# Altium project PCE_ROBOT.PrjPCB
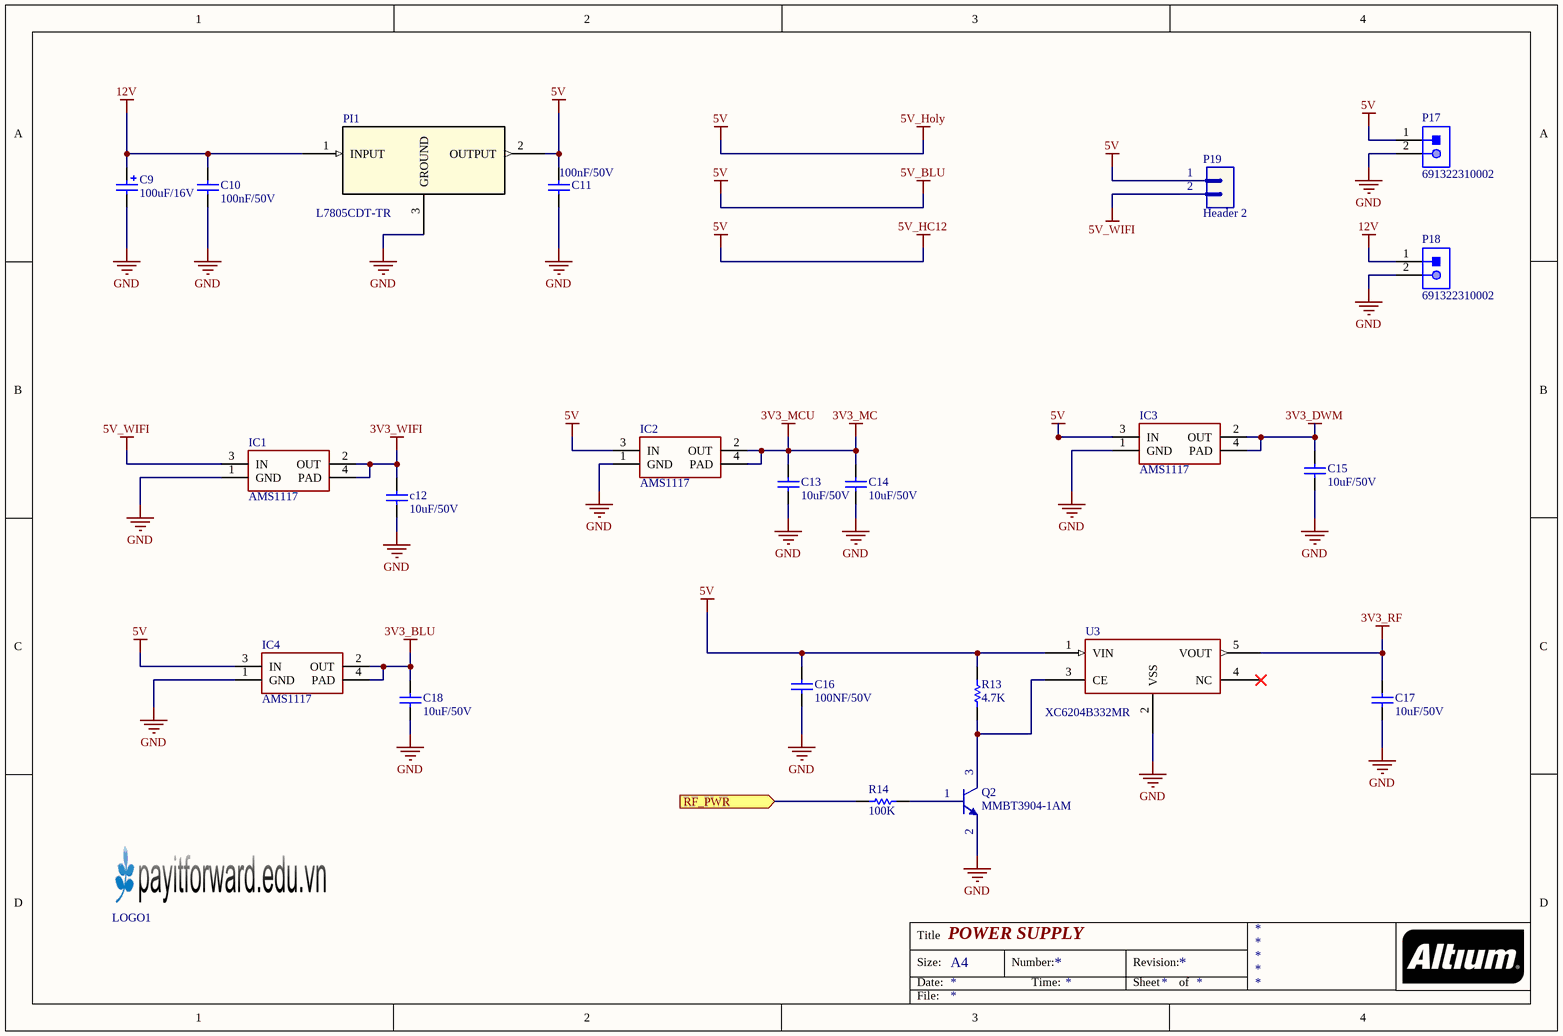
[diagram p0: POWER_SUPPLY.SchDoc]
8 sheets, 154 parts. Net scope: flat (ports and power ports of the same name join across sheets).
Board file: cainaylacaicuoihualuona.PcbDoc
Sheets:
  POWER_SUPPLY.SchDoc
  MCU.SchDoc
  SENSOR.SchDoc
  MOTOR_CONTROL.SchDoc
  BLUETOOTH.SchDoc
  WIFI.SchDoc
  RF.SchDoc
  DACEWAVE.SchDoc

## Sheet POWER_SUPPLY.SchDoc: POWER SUPPLY
size A4

### Parts
C9  value 100uF/16V  [CAP-SM-AL-SIZE-D-D6L6]  (hidden comment: Cap-Al-47uF-50V-D6L8)
C10  value 100nF/50V  [CAP-SM-0805]  (hidden comment: Cap-100nF-50V-0805)
C11  value 100nF/50V  [CAP-SM-0805]  (hidden comment: Cap-100nF-50V-0805)
c12  value 10uF/50V  [CAP-SM-0805]  (hidden comment: Cap-10uF-50V-0805)
C13  value 10uF/50V  [CAP-SM-0805]  (hidden comment: Cap-10uF-50V-0805)
C14  value 10uF/50V  [CAP-SM-0805]  (hidden comment: Cap-10uF-50V-0805)
C15  value 10uF/50V  [CAP-SM-0805]  (hidden comment: Cap-10uF-50V-0805)
C16  value 100NF/50V  [CAP-SM-0805]  (hidden comment: Cap-10uF-50V-0805)
C17  value 10uF/50V  [CAP-SM-0805]  (hidden comment: Cap-10uF-50V-0805)
C18  value 10uF/50V  [CAP-SM-0805]  (hidden comment: Cap-10uF-50V-0805)
IC1  AMS1117  [SOT223]
IC2  AMS1117  [SOT223]
IC3  AMS1117  [SOT223]
IC4  AMS1117  [SOT223]
LOGO1  LOGO PIF  [PIF LOGO BIG SSTOP]  (value not drawn)
P17  691322310002  [691322310002]
P18  691322310002  [691322310002]
P19  Header 2  [JP2]
PI1  L7805CDT-TR  [L7805]
Q2  MMBT3904-1AM  [SOT23_NEX]
R13  value 4.7K  [RES-SM-0805]  (hidden comment: Res-0-0805)
R14  value 100K  [RES-SM-0805]  (hidden comment: Res-0-0805)
U3  XC6204B332MR  [XC6204/05_SOT-00]

### Ports
RF_PWR (in)

### Nets
3V3_BLU: C18.2 IC4.2(OUT) IC4.4(PAD)
3V3_DWM: C15.2 IC3.2(OUT) IC3.4(PAD)
3V3_MCU: C13.2 C14.2 IC2.2(OUT) IC2.4(PAD)  [also labelled 3V3_MC]
3V3_RF: C17.2 U3.5(VOUT)
3V3_WIFI: c12.2 IC1.2(OUT) IC1.4(PAD)
5V: C11.2 C16.2 IC2.3(IN) IC3.3(IN) IC4.3(IN) P17.1 P19.1 PI1.2(OUTPUT) R13.1 U3.1(VIN)  [also labelled 5V_BLU, 5V_HC12, 5V_Holy]
5V_WIFI: IC1.3(IN) P19.2
12V: C9.1 C10.2 P18.1 PI1.1(INPUT)
GND: C9.2 C10.1 C11.1 c12.1 C13.1 C14.1 C15.1 C16.1 C17.1 C18.1 IC1.1(GND) IC2.1(GND) IC3.1(GND) IC4.1(GND) P17.2 P18.2 PI1.3(GROUND) Q2.2(E) U3.2(VSS)
Net?_15: R14.1 ; port RF_PWR
NetQ2_1: Q2.1(B) R14.2
NetQ2_3: Q2.3(C) R13.2 U3.3(CE)

Not connected (* = marked no-connect by the designer): U3 4(NC)*

### Notes on the sheet
- Title
- Size:
- Date:
- A4
- Number:
- Time:
- Revision:
- Sheet
- of
- File:

### Library data of the parts
C9 = Cap-Al-47uF-50V-D6L8: CAP ALUM POLY 47UF 20% 50V SMD; Manufacturer: KEMET; Manufacturer Part Number: A767KN476M1HLAE029; Local Supplier: thegioiic; Local Supplier Link: https://thegioiic.com/products/tu-nhom-smd-47uf-50v-d6l8; Supplier 1: Digikey; Supplier 1 Link: https://www.digikey.com/product-detail/en/kemet/A767KN476M1HLAE029/399-16576-1-ND/7933076; Supplier 1 Part Number: 399-16576-1-ND
C10 C11 = Cap-100nF-50V-0805: CAP CER 0.1UF 50V Y5V 0805; Manufacturer: Samsung Electro-Mechanics; Manufacturer Part Number: CL21F104ZBCNNNC; Local Supplier: thegioiic; Local Supplier Link: https://thegioiic.com/products/tu-100nf-0-1uf-50v-0805; Supplier 1: Digikey; Supplier 1 Part Number: 1276-1007-1-ND; Supplier 1 Link: https://www.digikey.com/product-detail/en/samsung-electro-mechanics/CL21F104ZBCNNNC/1276-1007-1-ND/3889093
c12 C13-C18 = Cap-10uF-50V-0805: CAP CER 10UF 50V X5R 0805; Manufacturer: Yageo; Manufacturer Part Number: CC0805KKX5R9BB106; Local Supplier: thegioiic; Local Supplier Link: https://thegioiic.com/products/tu-10uf-50v-0805; Supplier 1: Digikey; Supplier 1 Link: https://www.digikey.com/product-detail/en/yageo/CC0805KKX5R9BB106/311-3499-2-ND/7164383; Supplier 1 Part Number: 311-3499-2-ND
IC1-IC4 = AMS1117: Available in 1.8V, 2.5V, 2.85V, 3.3V, 5V, and  Adjustable Versions; Value: LM317
P17 P18 = 691322310002: WR-TBL Serie 322 Horizontal PCB Header, Pluggable, pitch 3.81mm, 2p; Compliance: RoHS; Modularity: No; Pin Number: 2; Rated Current [UL]: 10A; Working Voltage [UL]: 300VAC; ComponentLink1Description: Manufacturer; ComponentLink1URL: http://www.we-online.de; ComponentLink2URL: https://katalog.we-online.de/em/datasheet/691322310002.pdf; ComponentLink2Description: Datasheet; Mounting Technology: THT; Part Number: 691322310002; Packaging: Box; Operating Temperature: -40 to +105degC; PCB/Cable/Panel: PCB; Pitch: 3.81mm; Published Date: October 2019; Type: Horizontal; Publisher: Wurth Elektronik; Application: Pluggable
P19 = Header 2: Header, 2-Pin; LatestRevisionDate: 17-Jul-2002; LatestRevisionNote: Re-released for DXP Platform.; Publisher: Altium Limited
PI1 = L7805: No Description Available; SourceLibrary: StMicro_2011-06-07; Built_By: EMA_UL_Team; Vendor: STMicroelectronics; Manufacturer_Part_Number: L7805CDT-TR; Copyright: Copyright (C) 2018 Accelerated Designs. All rights reserved; RefDes: RefDes; Type: DEV
R13 R14 = Res-0-0805: RES 0 OHM JUMPER 0805; Manufacturer: Vishay Dale; Manufacturer Part Number: WSL080500000ZEA9; Local Supplier: thegioiic; Local Supplier Link: https://thegioiic.com/products/dien-tro-0-ohm-0805-5; Supplier 1: Digikey; Supplier 1 Link: https://www.digikey.com/product-detail/en/vishay-dale/WSL080500000ZEA9/541-3928-1-ND/7423223; Supplier 1 Part Number: 541-3928-1-ND
U3 = XC6204B332MR: Vendor: Torex Semiconductor; Built_By: EMA_UL_Team; SourceLibrary: Torex_2016-07-05_1; Manufacturer_Part_Number: XC6204B332MR; Copyright: Copyright (C) 2018 Accelerated Designs. All rights reserved; RefDes: RefDes; Type: DEV

## Sheet MCU.SchDoc: MCU
size A4
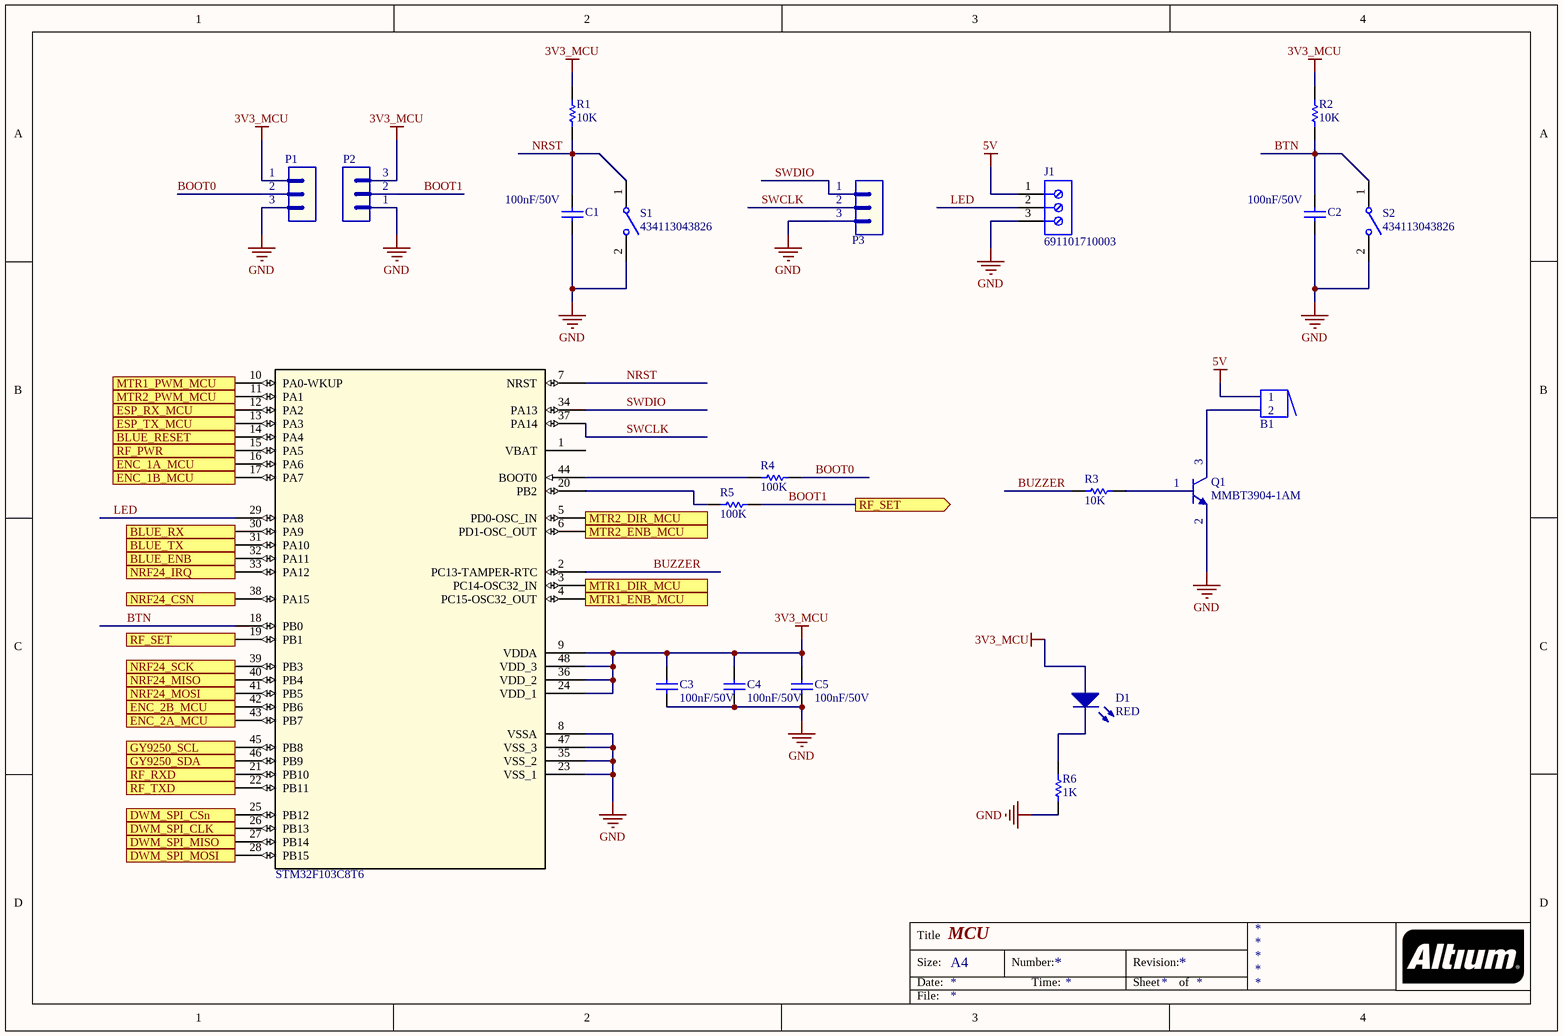
[diagram p1: MCU.SchDoc]

### Parts
?  STM32F103C8T6  [STM32]
B1  Buzzer  [BUZZER]  (value not drawn)
C1  value 100nF/50V  [CAP-SM-0805]  (hidden comment: Cap-1nF-50V-0805)
C2  value 100nF/50V  [CAP-SM-0805]  (hidden comment: Cap-1nF-50V-0805)
C3  value 100nF/50V  [CAP-SM-0805]  (hidden comment: Cap-100pF-50V-0805)
C4  value 100nF/50V  [CAP-SM-0805]  (hidden comment: Cap-100pF-50V-0805)
C5  value 100nF/50V  [CAP-SM-0805]  (hidden comment: Cap-100pF-50V-0805)
D1  RED  [LED_0805_Blue]
J1  691101710003  [691101710003]
P1  Header 3  [JP3]  (value not drawn)
P2  Header 3  [JP3]  (value not drawn)
P3  Header 3  [JP3]  (value not drawn)
Q1  MMBT3904-1AM  [SOT23_NEX]
R1  value 10K  [RES-SM-0805]  (hidden comment: Res-0-0805)
R2  value 10K  [RES-SM-0805]  (hidden comment: Res-0-0805)
R3  value 10K  [RES-SM-0805]  (hidden comment: Res-0-0805)
R4  value 100K  [RES-SM-0805]  (hidden comment: Res-0-0805)
R5  value 100K  [RES-SM-0805]  (hidden comment: Res-0-0805)
R6  value 1K  [RES-SM-0805]  (hidden comment: Res-0-0805)
S1  434113043826  [434113043826]
S2  434113043826  [434113043826]

### Ports
BLUE_ENB (out), BLUE_RESET (out), BLUE_RX (out), BLUE_TX (in), DWM_SPI_CLK (out), DWM_SPI_CSn (out), DWM_SPI_MISO (in), DWM_SPI_MOSI (out), ENC_1A_MCU (in), ENC_1B_MCU (in), ENC_2A_MCU (in), ENC_2B_MCU (in), ESP_RX_MCU (out), ESP_TX_MCU (in), GY9250_SCL (out), GY9250_SDA (out), MTR1_DIR_MCU (out), MTR1_ENB_MCU (out), MTR1_PWM_MCU (out), MTR2_DIR_MCU (out), MTR2_ENB_MCU (out), MTR2_PWM_MCU (out), NRF24_CSN (out), NRF24_IRQ (in), NRF24_MISO (in), NRF24_MOSI (out), NRF24_SCK (out), RF_PWR (out), RF_RXD (out), RF_SET (out), RF_TXD (in)

### Nets
3V3_MCU: ?.9(VDDA) ?.24(VDD_1) ?.36(VDD_2) ?.48(VDD_3) C3.1 C4.1 C5.1 D1.1(A) P1.1 P2.3 R1.2 R2.2
5V: B1.1 J1.1
GND: ?.8(VSSA) ?.23(VSS_1) ?.35(VSS_2) ?.47(VSS_3) C1.1 C2.1 C3.2 C4.2 C5.2 J1.3 P1.3 P2.1 P3.3 Q1.2(E) R6.1 S1.2 S2.2
BLUE_ENB: ?.32(PA11) ; port BLUE_ENB
BLUE_RX: ?.30(PA9) ; port BLUE_RX
BLUE_TX: ?.31(PA10) ; port BLUE_TX
BOOT0: P1.2 R4.2
BOOT1: ?.19(PB1) P2.2 R5.2 ; port RF_SET
BTN: ?.18(PB0) C2.2 R2.1 S2.1
BUZZER: ?.2(PC13-TAMPER-RTC) R3.2
ESP_TX: ?.13(PA3) ; port ESP_TX_MCU
LED: ?.29(PA8) J1.2
NRST: ?.7(NRST) C1.2 R1.1 S1.1
RF_RXD: ?.21(PB10) ; port RF_RXD
RF_TXD: ?.22(PB11) ; port RF_TXD
SWCLK: ?.37(PA14) P3.2
SWDIO: ?.34(PA13) P3.1
Net*_26: ?.27(PB14) ; port DWM_SPI_MISO
Net*_27: ?.28(PB15) ; port DWM_SPI_MOSI
Net*_28: ?.26(PB13) ; port DWM_SPI_CLK
Net*_29: ?.25(PB12) ; port DWM_SPI_CSn
Net?_3: ?.3(PC14-OSC32_IN) ; port MTR1_DIR_MCU
Net?_4: ?.4(PC15-OSC32_OUT) ; port MTR1_ENB_MCU
Net?_5: ?.5(PD0-OSC_IN) ; port MTR2_DIR_MCU
Net?_6: ?.6(PD1-OSC_OUT) ; port MTR2_ENB_MCU
Net?_10: ?.10(PA0-WKUP) ; port MTR1_PWM_MCU
Net?_11: ?.11(PA1) ; port MTR2_PWM_MCU
Net?_12: ?.12(PA2) ; port ESP_RX_MCU
Net?_14: ?.14(PA4) ; port BLUE_RESET
Net?_15: ?.15(PA5) ; port RF_PWR
Net?_16: ?.16(PA6) ; port ENC_1A_MCU
Net?_17: ?.17(PA7) ; port ENC_1B_MCU
Net?_20: ?.20(PB2) R5.1
Net?_33: ?.33(PA12) ; port NRF24_IRQ
Net?_38: ?.38(PA15) ; port NRF24_CSN
Net?_39: ?.39(PB3) ; port NRF24_SCK
Net?_40: ?.40(PB4) ; port NRF24_MISO
Net?_41: ?.41(PB5) ; port NRF24_MOSI
Net?_42: ?.42(PB6) ; port ENC_2B_MCU
Net?_43: ?.43(PB7) ; port ENC_2A_MCU
Net?_44: ?.44(BOOT0) R4.1
Net?_45: ?.45(PB8) ; port GY9250_SCL
Net?_46: ?.46(PB9) ; port GY9250_SDA
NetB1_2: B1.2 Q1.3(C)
NetD1_2: D1.2(K) R6.2
NetQ1_1: Q1.1(B) R3.1

Not connected (* = marked no-connect by the designer): ? 1(VBAT)

### Notes on the sheet
- Title
- Size:
- Date:
- A4
- Number:
- Time:
- Revision:
- Sheet
- of
- File:

### Library data of the parts
? = STM32F103C8T6: No Description Available; SourceLibrary: StMicro_2011-06-07; Built_By: EMA_UL_Team; Vendor: STMicroelectronics; Manufacturer_Part_Number: STM32F103C8T6; Copyright: Copyright (C) 2018 Accelerated Designs. All rights reserved; RefDes: RefDes; Type: DEV
C1 C2 = Cap-1nF-50V-0805: CAP CER 1000PF 100V X7R 0805; Manufacturer: Johanson Dielectrics Inc.; Manufacturer Part Number: 101X15W102MV4E; Local Supplier: thegioiic; Local Supplier Link: https://thegioiic.com/products/tu-1nf-50v-0805; Supplier 1: Digikey; Supplier 1 Link: https://www.digikey.com/product-detail/en/johanson-dielectrics-inc/101X15W102MV4E/709-1335-1-ND/2327235; Supplier 1 Part Number: 709-1335-1-ND
C3-C5 = Cap-100pF-50V-0805: CAP CER 100PF 50V C0G/NP0 0805; Manufacturer: KEMET; Manufacturer Part Number: C0805C101J5GACTU; Local Supplier: thegioiic; Local Supplier Link: https://thegioiic.com/products/tu-100pf-50v-0805; Supplier 1: Digikey; Supplier 1 Part Number: 399-1122-1-ND; Supplier 1 Link: https://www.digikey.com/product-detail/en/kemet/C0805C101J5GACTU/399-1122-1-ND/411397
D1 = LED
J1 = 691101710003: WR-TBL Serie 101 Horizontal Entry Modular, Pressure Clamp, pitch 5mm, 3p; Compliance: Lead free / RoHS; Modularity: Yes; PCB/Cable/Panel: PCB; Pin Number: 3; Rated Current [UL]: 16A; Working Voltage [UL]: 250VAC; ComponentLink1Description: Manufacturer; ComponentLink1URL: http://www.we-online.de; ComponentLink2URL: https://katalog.we-online.de/em/datasheet/691101710003.pdf; ComponentLink2Description: Datasheet; Mounting Technology: THT; Part Number: 691101710003; Packaging: Box; Operating Temperature: -40 to +105degC; Pitch: 5mm; Published Date: October 2019; Type: Horizontal; Publisher: Wurth Elektronik; Application: Pressure Clamp
P1-P3 = Header 3: Header, 3-Pin; LatestRevisionDate: 17-Jul-2002; LatestRevisionNote: Re-released for DXP Platform.; Publisher: Altium Limited
R1-R6 = Res-0-0805: as R13 on sheet POWER_SUPPLY; Local Supplier: thegioiic; Local Supplier Link: https://thegioiic.com/products/dien-tro-0-ohm-0805-5; Supplier 1: Digikey; Supplier 1 Link: https://www.digikey.com/product-detail/en/vishay-dale/WSL080500000ZEA9/541-3928-1-ND/7423223; Supplier 1 Part Number: 541-3928-1-ND
S1 S2 = 434113043826: WS-TASV J-Bend SMT Tact Switch 6x3.5mm, height 4.3mm, 260gf; Rated Voltage: 12VDC; Rated Current: 50mA; Washable: No; ComponentLink1Description: Manufacturer; ComponentLink1URL: http://www.we-online.de; ComponentLink2Description: Datasheet; ComponentLink2URL: https://katalog.we-online.com/em/datasheet/434113043826.pdf; Operating Temperature: -40 to +85degC; Part Number: 434113043826; Published Date: September 2019; Contact Material: Stainless Steel; Height: 4.3mm; Mounting Technology: SMT; Contact Plating: Silver; Operation Force: 260gf; Packaging: Tape and Reel; Terminal Material: Copper Alloy; Publisher: Wurth Elektronik; Terminal Plating: Silver

## Sheet SENSOR.SchDoc: SENSOR
size A4
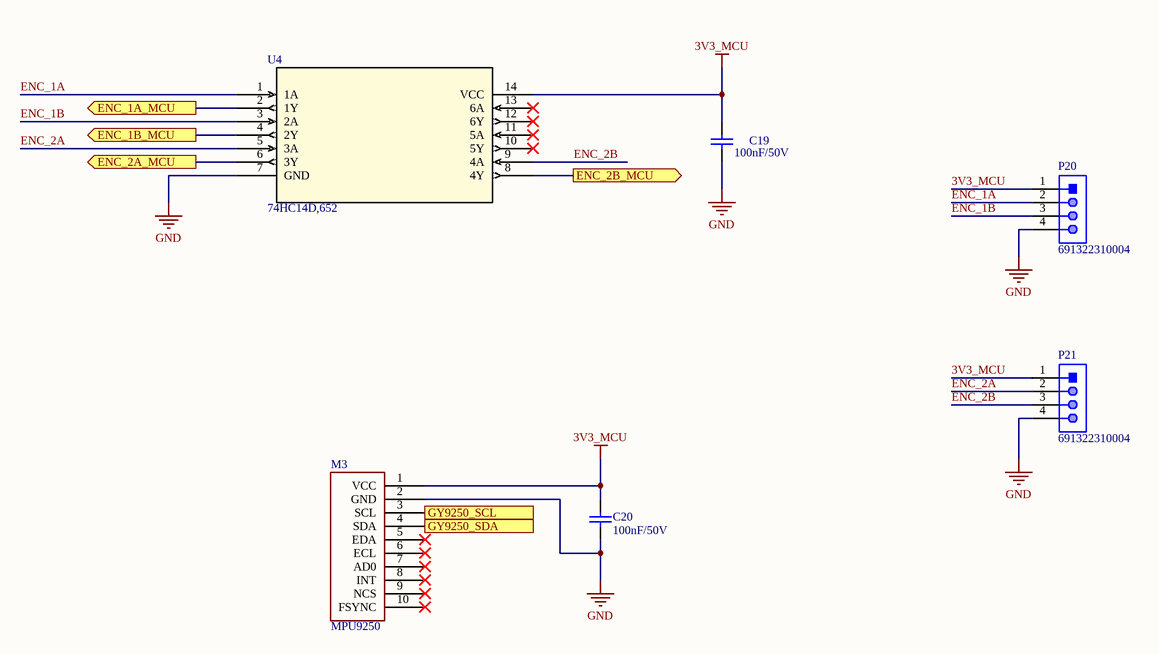
[diagram p2: SENSOR.SchDoc]

### Parts
C19  value 100nF/50V  [CAP-SM-0805]  (hidden comment: Cap-1nF-50V-0805)
C20  value 100nF/50V  [CAP-SM-0805]  (hidden comment: Cap-1nF-50V-0805)
M3  MPU9250  [MPU9250]
P20  691322310004  [691322310004]
P21  691322310004  [691322310004]
U4  74HC14D,652  [74hc14d]

### Ports
ENC_1A_MCU (out), ENC_1B_MCU (out), ENC_2A_MCU (out), ENC_2B_MCU (out), GY9250_SCL (in), GY9250_SDA (in)

### Nets
3V3_MCU: C19.2 C20.2 M3.1(VCC) P20.1 P21.1 U4.14(VCC)
GND: C19.1 C20.1 M3.2(GND) P20.4 P21.4 U4.7(GND)
ENC_1A: P20.2 U4.1(1A)
ENC_1B: P20.3 U4.3(2A)
ENC_2A: P21.2 U4.5(3A)
ENC_2B: P21.3 U4.9(4A)
Net?_16: U4.2(1Y) ; port ENC_1A_MCU
Net?_17: U4.4(2Y) ; port ENC_1B_MCU
Net?_42: U4.8(4Y) ; port ENC_2B_MCU
Net?_43: U4.6(3Y) ; port ENC_2A_MCU
Net?_45: M3.3(SCL) ; port GY9250_SCL
Net?_46: M3.4(SDA) ; port GY9250_SDA

Not connected (* = marked no-connect by the designer): M3 5(EDA)* 6(ECL)* 7(AD0)* 8(INT)* 9(NCS)* 10(FSYNC)*; U4 10(5Y)* 11(5A)* 12(6Y)* 13(6A)*

### Notes on the sheet
- Title
- Size:
- Date:
- A4
- Number:
- Time:
- Revision:
- Sheet
- of
- File:

### Library data of the parts
C19 C20 = Cap-1nF-50V-0805: as C1 on sheet MCU; Local Supplier: thegioiic; Local Supplier Link: https://thegioiic.com/products/tu-1nf-50v-0805; Supplier 1: Digikey; Supplier 1 Link: https://www.digikey.com/product-detail/en/johanson-dielectrics-inc/101X15W102MV4E/709-1335-1-ND/2327235; Supplier 1 Part Number: 709-1335-1-ND
P20 P21 = 691322310004: WR-TBL Serie 322 Horizontal PCB Header, Pluggable, pitch 3.81mm, 4p; Compliance: RoHS; Modularity: No; Pin Number: 4; Rated Current [UL]: 10A; Working Voltage [UL]: 300VAC; ComponentLink1Description: Manufacturer; ComponentLink1URL: http://www.we-online.de; ComponentLink2URL: https://katalog.we-online.de/em/datasheet/691322310004.pdf; ComponentLink2Description: Datasheet; Mounting Technology: THT; Part Number: 691322310004; Packaging: Box; Operating Temperature: -40 to +105degC; PCB/Cable/Panel: PCB; Pitch: 3.81mm; Published Date: October 2019; Type: Horizontal; Publisher: Wurth Elektronik; Application: Pluggable
U4 = 74HC14D,652: No Description Available; Vendor: Nexperia; SourceLibrary: Nexperia_2018-05-2018; Manufacturer_Part_Number: 74HC14D,652; Copyright: Copyright (C) 2016 Accelerated Designs. All rights reserved; RefDes: RefDes; Type: DEV

## Sheet MOTOR_CONTROL.SchDoc: MOTOR CONTROL
size A4
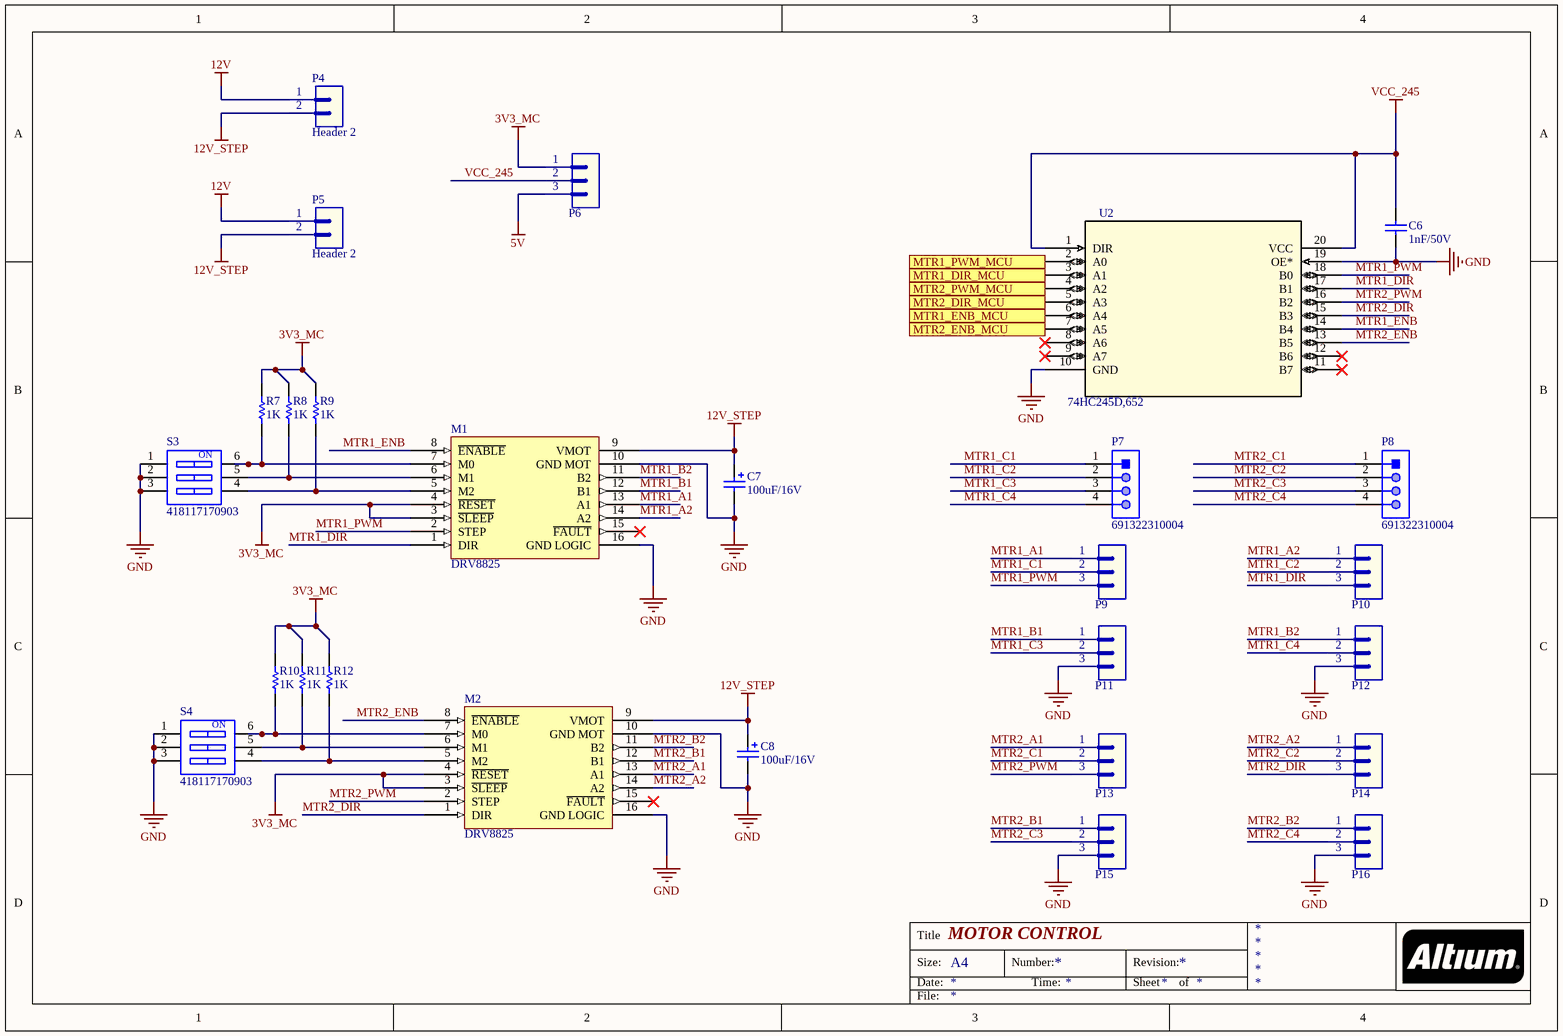
[diagram p3: MOTOR_CONTROL.SchDoc]

### Parts
C6  value 1nF/50V  [CAP-SM-0805]  (hidden comment: Cap-1nF-50V-0805)
C7  value 100uF/16V  [CAP_SM_TAN]  (hidden comment: TAJB107M006RNJ)
C8  value 100uF/16V  [CAP_SM_TAN]  (hidden comment: TAJB107M006RNJ)
M1  DRV8825  [DRV8825]
M2  DRV8825  [DRV8825]
P4  Header 2  [JP2]
P5  Header 2  [JP2]
P6  Header 3  [JP3]  (value not drawn)
P7  691322310004  [691322310004]
P8  691322310004  [691322310004]
P9  Header 3  [JP3]  (value not drawn)
P10  Header 3  [JP3]  (value not drawn)
P11  Header 3  [JP3]  (value not drawn)
P12  Header 3  [JP3]  (value not drawn)
P13  Header 3  [JP3]  (value not drawn)
P14  Header 3  [JP3]  (value not drawn)
P15  Header 3  [JP3]  (value not drawn)
P16  Header 3  [JP3]  (value not drawn)
R7  value 1K  [RES-SM-0805]  (hidden comment: Res-0-0805)
R8  value 1K  [RES-SM-0805]  (hidden comment: Res-0-0805)
R9  value 1K  [RES-SM-0805]  (hidden comment: Res-0-0805)
R10  value 1K  [RES-SM-0805]  (hidden comment: Res-0-0805)
R11  value 1K  [RES-SM-0805]  (hidden comment: Res-0-0805)
R12  value 1K  [RES-SM-0805]  (hidden comment: Res-0-0805)
S3  418117170903  [418117170903]
S4  418117170903  [418117170903]
U2  74HC245D,652  [74hc245d]

### Ports
MTR1_DIR_MCU (in), MTR1_ENB_MCU (in), MTR1_PWM_MCU (in), MTR2_DIR_MCU (in), MTR2_ENB_MCU (in), MTR2_PWM_MCU (in)

### Nets
3V3_MC: M1.3(~{SLEEP}) M1.4(~{RESET}) M2.3(~{SLEEP}) M2.4(~{RESET}) P6.1 R7.2 R8.2 R9.2 R10.2 R11.2 R12.2  [project net 3V3_MCU]
5V: P6.3
12V: P4.1 P5.1
12V_STEP: C7.1 C8.1 M1.9(VMOT) M2.9(VMOT) P4.2 P5.2
GND: C6.2 C7.2 C8.2 M1.10(GND_MOT) M1.16(GND_LOGIC) M2.10(GND_MOT) M2.16(GND_LOGIC) P11.3 P12.3 P15.3 P16.3 S3.1 S3.2 S3.3 S4.1 S4.2 S4.3 U2.10(GND) U2.19(OE*)
VCC_245: C6.1 P6.2 U2.1(DIR) U2.20(VCC)
MTR1_A1: M1.13(A1) P9.1
MTR1_A2: M1.14(A2) P10.1
MTR1_B1: M1.12(B1) P11.1
MTR1_B2: M1.11(B2) P12.1
MTR1_C1: P7.1 P9.2
MTR1_C2: P7.2 P10.2
MTR1_C3: P7.3 P11.2
MTR1_C4: P7.4 P12.2
MTR1_DIR: M1.1(DIR) P10.3 U2.17(B1)
MTR1_ENB: M1.8(~{ENABLE}) U2.14(B4)
MTR1_PWM: M1.2(STEP) P9.3 U2.18(B0)
MTR2_A1: M2.13(A1) P13.1
MTR2_A2: M2.14(A2) P14.1
MTR2_B1: M2.12(B1) P15.1
MTR2_B2: M2.11(B2) P16.1
MTR2_C1: P8.1 P13.2
MTR2_C2: P8.2 P14.2
MTR2_C3: P8.3 P15.2
MTR2_C4: P8.4 P16.2
MTR2_DIR: M2.1(DIR) P14.3 U2.15(B3)
MTR2_ENB: M2.8(~{ENABLE}) U2.13(B5)
MTR2_PWM: M2.2(STEP) P13.3 U2.16(B2)
Net?_3: U2.3(A1) ; port MTR1_DIR_MCU
Net?_4: U2.6(A4) ; port MTR1_ENB_MCU
Net?_5: U2.5(A3) ; port MTR2_DIR_MCU
Net?_6: U2.7(A5) ; port MTR2_ENB_MCU
Net?_10: U2.2(A0) ; port MTR1_PWM_MCU
Net?_11: U2.4(A2) ; port MTR2_PWM_MCU
NetM1_5: M1.5(M2) R9.1 S3.4
NetM1_6: M1.6(M1) R8.1 S3.5
NetM1_7: M1.7(M0) R7.1 S3.6
NetM2_5: M2.5(M2) R12.1 S4.4
NetM2_6: M2.6(M1) R11.1 S4.5
NetM2_7: M2.7(M0) R10.1 S4.6

Not connected (* = marked no-connect by the designer): M1 15(~{FAULT})*; M2 15(~{FAULT})*; U2 8(A6)* 9(A7)* 11(B7)* 12(B6)*

### Notes on the sheet
- Title
- Size:
- Date:
- A4
- Number:
- Time:
- Revision:
- Sheet
- of
- File:
- (in symbol 418117170903) ON

### Library data of the parts
C6 = Cap-1nF-50V-0805: as C1 on sheet MCU; Local Supplier: thegioiic; Local Supplier Link: https://thegioiic.com/products/tu-1nf-50v-0805; Supplier 1: Digikey; Supplier 1 Link: https://www.digikey.com/product-detail/en/johanson-dielectrics-inc/101X15W102MV4E/709-1335-1-ND/2327235; Supplier 1 Part Number: 709-1335-1-ND
C7 C8 = Cap-Tan-100uF-16V: Manufacturer: Nichicon; Manufacturer Part Number: UWX1C101MCL1GB; Local Supplier: icdayroi; Local Supplier Link: https://icdayroi.com/tu-tantalum-100uf-16v-smd6032; Supplier 1: Digikey; Supplier 1 Part Number: 493-2105-1-ND; Supplier 1 Link: https://www.digikey.com/product-detail/en/nichicon/UWX1C101MCL1GB/493-2105-1-ND/590080
P4 P5 = Header 2: Header, 2-Pin; LatestRevisionDate: 17-Jul-2002; LatestRevisionNote: Re-released for DXP Platform.; Publisher: Altium Limited
P6 P9-P16 = Header 3: Header, 3-Pin; LatestRevisionDate: 17-Jul-2002; LatestRevisionNote: Re-released for DXP Platform.; Publisher: Altium Limited
P7 P8 = 691322310004: as P20 on sheet SENSOR; ComponentLink1Description: Manufacturer; ComponentLink1URL: http://www.we-online.de; ComponentLink2URL: https://katalog.we-online.de/em/datasheet/691322310004.pdf; ComponentLink2Description: Datasheet; Mounting Technology: THT; Part Number: 691322310004; Packaging: Box; Operating Temperature: -40 to +105degC; PCB/Cable/Panel: PCB; Pitch: 3.81mm; Published Date: October 2019; Type: Horizontal; Publisher: Wurth Elektronik; Application: Pluggable
R7-R12 = Res-0-0805: as R13 on sheet POWER_SUPPLY; Local Supplier: thegioiic; Local Supplier Link: https://thegioiic.com/products/dien-tro-0-ohm-0805-5; Supplier 1: Digikey; Supplier 1 Link: https://www.digikey.com/product-detail/en/vishay-dale/WSL080500000ZEA9/541-3928-1-ND/7423223; Supplier 1 Part Number: 541-3928-1-ND
S3 S4 = 418117170903: WS-DITV Compact THT Dip Switch, Flat Actuator, pitch 2.54mm, 3p; Operation Force: 800g; Pole Number: 3; Actuator Type: Flat Type; Circuit: SPST-NO; Rated Current Switching: 25mA; Rated Current Non-Switching: 100mA; Rated Voltage Non-Switching: 50VDC; Rated Voltage Switching: 24VDC; ComponentLink1Description: Manufacturer; ComponentLink1URL: http://www.we-online.de; ComponentLink2Description: Datasheet; ComponentLink2URL: https://katalog.we-online.com/em/datasheet/418117170903.pdf; Pitch: 2.54mm; Contact Material: Copper Alloy; Mounting Technology: THT; Operating Temperature: -40 to +85degC; Contact Plating: Gold; Packaging: Tube; Part Number: 418117170903; Publisher: Wurth Elektronik; Published Date: September 2019
U2 = 74HC245D,652: No Description Available; Vendor: Nexperia; SourceLibrary: Nexperia_2018-05-2018; Manufacturer_Part_Number: 74HC245D,652; Copyright: Copyright (C) 2016 Accelerated Designs. All rights reserved; RefDes: RefDes; Type: DEV

## Sheet BLUETOOTH.SchDoc: BLUETOOTH
size A4
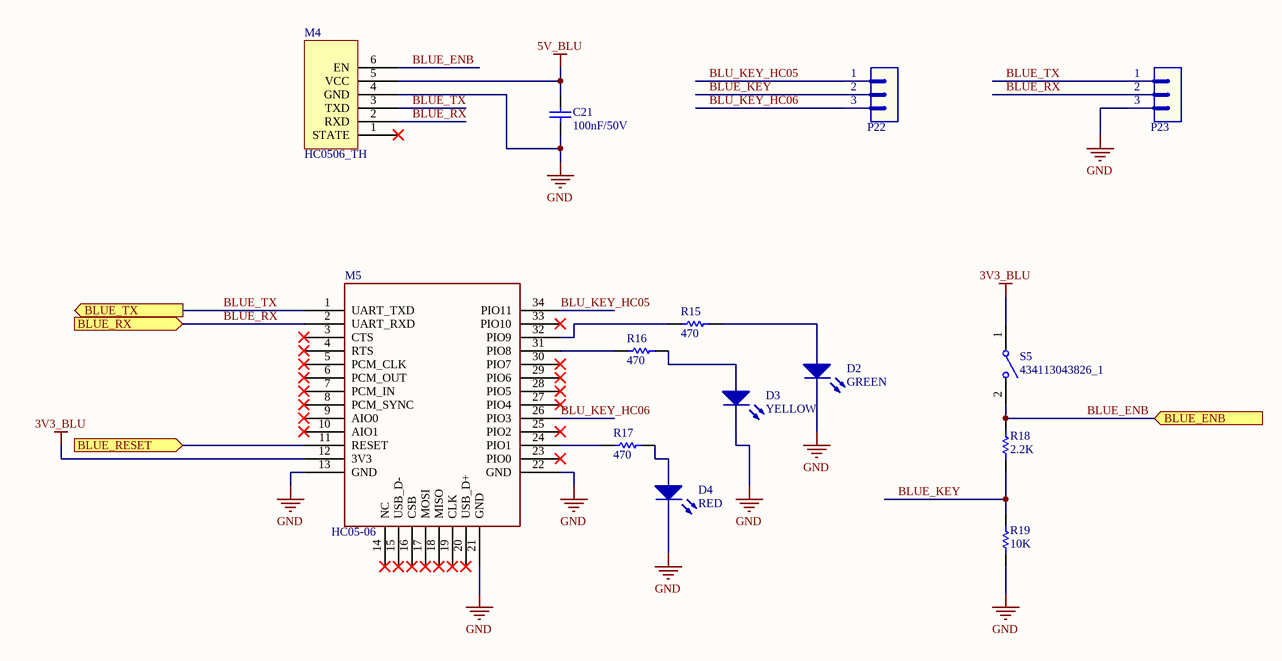
[diagram p4: BLUETOOTH.SchDoc]

### Parts
C21  value 100nF/50V  [CAP-SM-0805]  (hidden comment: Cap-1nF-50V-0805)
D2  GREEN  [LED_0805_Blue]
D3  YELLOW  [LED_0805_Blue]
D4  RED  [LED_0805_Blue]
M4  HC0506_TH  [PCBComponent_1]
M5  HC05-06  [HC05-06]
P22  Header 3  [JP3]  (value not drawn)
P23  Header 3  [JP3]  (value not drawn)
R15  value 470  [RES-SM-0805]  (hidden comment: Res-0-0805)
R16  value 470  [RES-SM-0805]  (hidden comment: Res-0-0805)
R17  value 470  [RES-SM-0805]  (hidden comment: Res-0-0805)
R18  value 2.2K  [RES-SM-0805]  (hidden comment: Res-0-0805)
R19  value 10K  [RES-SM-0805]  (hidden comment: Res-0-0805)
S5  434113043826_1  [434113043826]

### Ports
BLUE_ENB (in), BLUE_RESET (in), BLUE_RX (in), BLUE_TX (out)

### Nets
3V3_BLU: M5.12(3V3) S5.1
5V_BLU: C21.2 M4.5(VCC)  [project net 5V]
GND: C21.1 D2.2(K) D3.2(K) D4.2(K) M4.4(GND) M5.13(GND) M5.21(GND) M5.22(GND) P23.3 R19.2
BLU_KEY_HC05: M5.34(PIO11) P22.1
BLU_KEY_HC06: M5.26(PIO3) P22.3
BLUE_ENB: M4.6(EN) R18.1 S5.2 ; port BLUE_ENB
BLUE_KEY: P22.2 R18.2 R19.1
BLUE_RX: M4.2(RXD) M5.2(UART_RXD) P23.2 ; port BLUE_RX
BLUE_TX: M4.3(TXD) M5.1(UART_TXD) P23.1 ; port BLUE_TX
Net?_14: M5.11(RESET) ; port BLUE_RESET
NetD2_1: D2.1(A) R15.2
NetD3_1: D3.1(A) R16.2
NetD4_1: D4.1(A) R17.2
NetM5_24: M5.24(PIO1) R17.1
NetM5_31: M5.31(PIO8) R16.1
NetM5_32: M5.32(PIO9) R15.1

Not connected (* = marked no-connect by the designer): M4 1(STATE)*; M5 3(CTS)* 4(RTS)* 5(PCM_CLK)* 6(PCM_OUT)* 7(PCM_IN)* 8(PCM_SYNC)* 9(AIO0)* 10(AIO1)* 14(NC)* 15(USB_D-)* 16(CSB)* 17(MOSI)* 18(MISO)* 19(CLK)* 20(USB_D+)* 23(PIO0)* 25(PIO2)* 27(PIO4)* 28(PIO5)* 29(PIO6)* 30(PIO7)* 33(PIO10)*

### Notes on the sheet
- Title
- Size:
- Date:
- A4
- Number:
- Time:
- Revision:
- Sheet
- of
- File:

### Library data of the parts
C21 = Cap-1nF-50V-0805: as C1 on sheet MCU; Local Supplier: thegioiic; Local Supplier Link: https://thegioiic.com/products/tu-1nf-50v-0805; Supplier 1: Digikey; Supplier 1 Link: https://www.digikey.com/product-detail/en/johanson-dielectrics-inc/101X15W102MV4E/709-1335-1-ND/2327235; Supplier 1 Part Number: 709-1335-1-ND
D2-D4 = LED
P22 P23 = Header 3: Header, 3-Pin; LatestRevisionDate: 17-Jul-2002; LatestRevisionNote: Re-released for DXP Platform.; Publisher: Altium Limited
R15-R19 = Res-0-0805: as R13 on sheet POWER_SUPPLY; Local Supplier: thegioiic; Local Supplier Link: https://thegioiic.com/products/dien-tro-0-ohm-0805-5; Supplier 1: Digikey; Supplier 1 Link: https://www.digikey.com/product-detail/en/vishay-dale/WSL080500000ZEA9/541-3928-1-ND/7423223; Supplier 1 Part Number: 541-3928-1-ND
S5 = 434113043826_1: WS-TASV J-Bend SMT Tact Switch 6x3.5mm, height 4.3mm, 260gf; Rated Voltage: 12VDC; Rated Current: 50mA; Washable: No; ComponentLink1Description: Manufacturer; ComponentLink1URL: http://www.we-online.de; ComponentLink2Description: Datasheet; ComponentLink2URL: https://katalog.we-online.com/em/datasheet/434113043826.pdf; Operating Temperature: -40 to +85degC; Part Number: 434113043826; Published Date: September 2019; Contact Material: Stainless Steel; Height: 4.3mm; Mounting Technology: SMT; Contact Plating: Silver; Operation Force: 260gf; Packaging: Tape and Reel; Terminal Material: Copper Alloy; Publisher: Wurth Elektronik; Terminal Plating: Silver
M4 = HC0506_TH: local supplier: Hshop; local supplier link: https://hshop.vn/products/mach-thu-phat-bluetooth-hc-05-do-ra-chon-master; local supplier part number: HS000882; manufacturer: *; manufacturer part number: *

## Sheet WIFI.SchDoc: WIFI
size A4
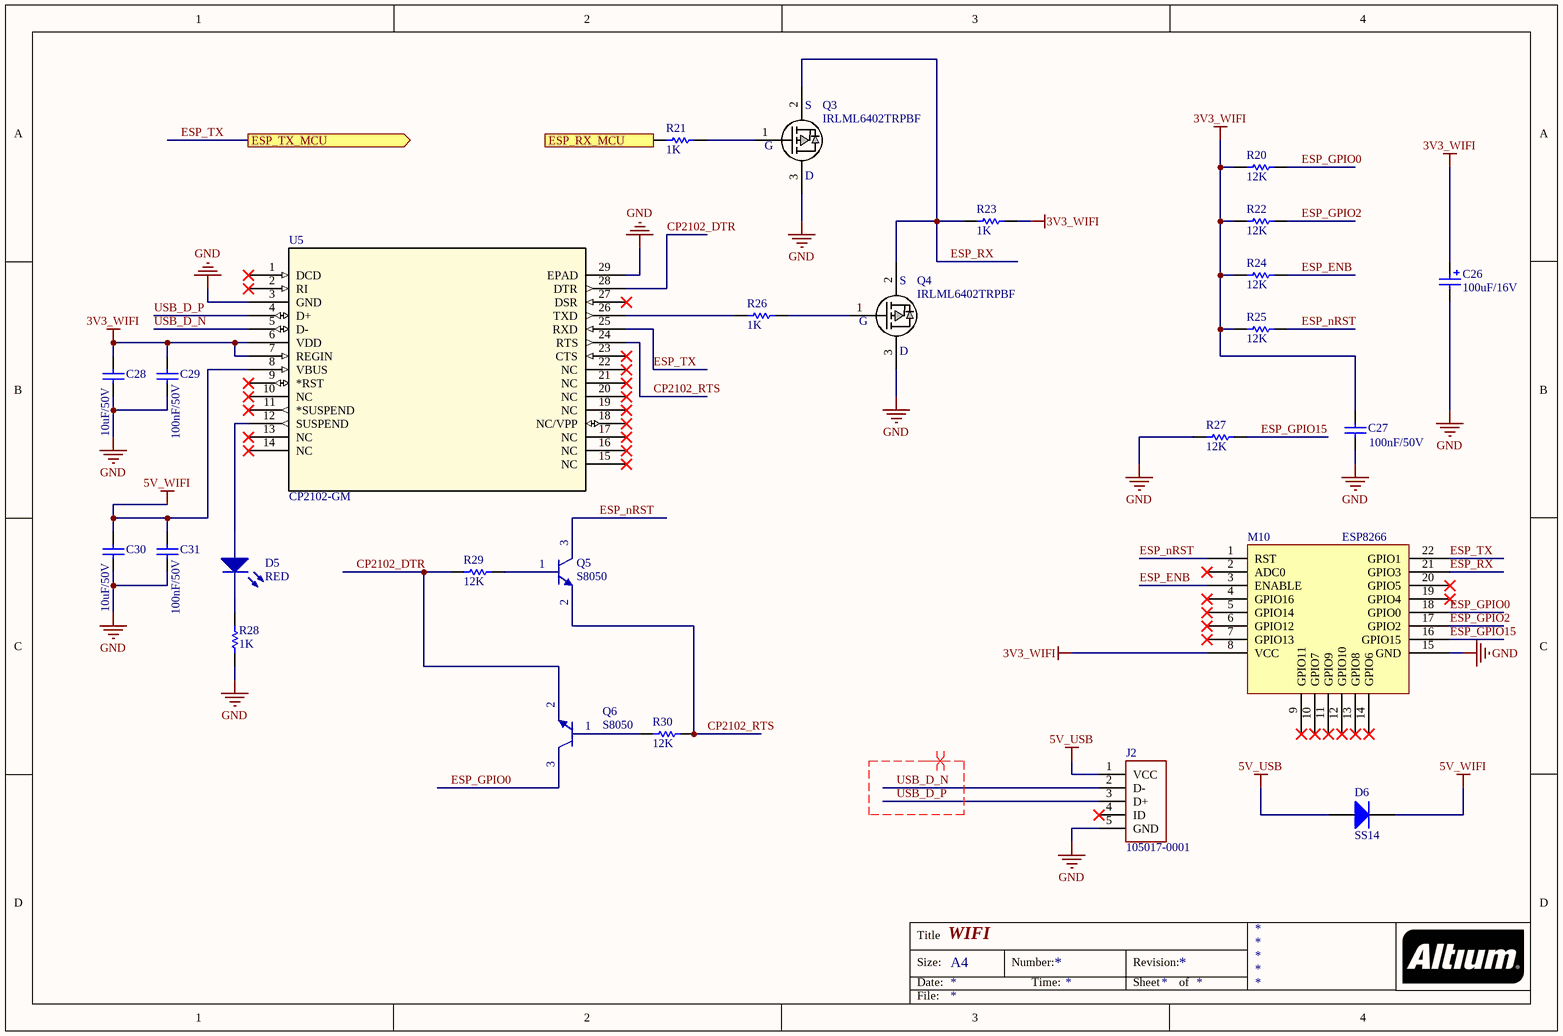
[diagram p5: WIFI.SchDoc]

### Parts
C26  value 100uF/16V  [CAP_SM_TAN]  (hidden comment: TAJB107M006RNJ)
C27  value 100nF/50V  [CAP-SM-0805]  (hidden comment: Cap-10uF-50V-0805)
C28  value 10uF/50V  [CAP-SM-0805]  (hidden comment: Cap-10uF-50V-0805)
C29  value 100nF/50V  [CAP-SM-0805]  (hidden comment: Cap-10uF-50V-0805)
C30  value 10uF/50V  [CAP-SM-0805]  (hidden comment: Cap-10uF-50V-0805)
C31  value 100nF/50V  [CAP-SM-0805]  (hidden comment: Cap-10uF-50V-0805)
D5  RED  [LED_0805_Blue]
D6  SS14  [SS14]
J2  105017-0001  [CONN_105017-0001]
M10  ESP8266  [ESP88]
Q3  IRLML6402TRPBF  [SOT23_NEX]
Q4  IRLML6402TRPBF  [SOT23_NEX]
Q5  S8050  [SOT23_NEX]
Q6  S8050  [SOT23_NEX]
R20  value 12K  [RES-SM-0805]  (hidden comment: Res-0-0805)
R21  value 1K  [RES-SM-0805]  (hidden comment: Res-0-0805)
R22  value 12K  [RES-SM-0805]  (hidden comment: Res-0-0805)
R23  value 1K  [RES-SM-0805]  (hidden comment: Res-0-0805)
R24  value 12K  [RES-SM-0805]  (hidden comment: Res-0-0805)
R25  value 12K  [RES-SM-0805]  (hidden comment: Res-0-0805)
R26  value 1K  [RES-SM-0805]  (hidden comment: Res-0-0805)
R27  value 12K  [RES-SM-0805]  (hidden comment: Res-0-0805)
R28  value 1K  [RES-SM-0805]  (hidden comment: Res-0-0805)
R29  value 12K  [RES-SM-0805]  (hidden comment: Res-0-0805)
R30  value 12K  [RES-SM-0805]  (hidden comment: Res-0-0805)
U5  CP2102-GM  [CP2102]

### Ports
ESP_RX_MCU (in), ESP_TX_MCU (out)

### Nets
3V3_WIFI: C26.1 C27.1 C28.1 C29.1 M10.8(VCC) R20.1 R22.1 R23.1 R24.1 R25.1 U5.6(VDD) U5.7(REGIN)
5V_USB: D6.2(A) J2.1(VCC)
5V_WIFI: C30.1 C31.1 D6.1(K) U5.8(VBUS)
GND: C26.2 C27.2 C28.2 C29.2 C30.2 C31.2 J2.5(GND) M10.15(GND) Q3.3(D) Q4.3(D) R27.1 R28.1 U5.3(GND) U5.29(EPAD)
CP2102_DTR: Q6.2(E) R29.1 U5.28(DTR)
CP2102_RTS: Q5.2(E) R30.2 U5.24(RTS)
ESP_ENB: M10.3(ENABLE) R24.2
ESP_GPIO0: M10.18(GPIO0) Q6.3(C) R20.2
ESP_GPIO2: M10.17(GPIO2) R22.2
ESP_GPIO15: M10.16(GPIO15) R27.2
ESP_nRST: M10.1(RST) Q5.3(C) R25.2
ESP_RX: M10.21(GPIO3) Q3.2(S) Q4.2(S) R23.2
ESP_TX: M10.22(GPIO1) U5.25(RXD) ; port ESP_TX_MCU
USB_D_N: J2.2(D-) U5.5(D-)
USB_D_P: J2.3(D+) U5.4(D+)
Net?_12: R21.1 ; port ESP_RX_MCU
NetD5_1: D5.1(A) U5.12(SUSPEND)
NetD5_2: D5.2(K) R28.2
NetQ3_1: Q3.1(G) R21.2
NetQ4_1: Q4.1(G) R26.2
NetQ5_1: Q5.1(B) R29.2
NetQ6_1: Q6.1(B) R30.1
NetR26_1: R26.1 U5.26(TXD)

Not connected (* = marked no-connect by the designer): J2 4(ID)*; M10 2(ADC0)* 4(GPIO16)* 5(GPIO14)* 6(GPIO12)* 7(GPIO13)* 9(GPIO11)* 10(GPIO7)* 11(GPIO9)* 12(GPIO10)* 13(GPIO8)* 14(GPIO6)* 19(GPIO4)* 20(GPIO5)*; U5 1(DCD)* 2(RI)* 9(*RST)* 10(NC)* 11(*SUSPEND)* 13(NC)* 14(NC)* 15(NC)* 16(NC)* 17(NC)* 18(NC/VPP)* 19(NC)* 20(NC)* 21(NC)* 22(NC)* 23(CTS)* 27(DSR)*

### Layout directives
differential pair: USB_D_N, USB_D_P

### Notes on the sheet
- Title
- Size:
- Date:
- A4
- Number:
- Time:
- Revision:
- Sheet
- of
- File:

### Library data of the parts
C26 = Cap-Tan-100uF-16V: as C7 on sheet MOTOR_CONTROL; Local Supplier: icdayroi; Local Supplier Link: https://icdayroi.com/tu-tantalum-100uf-16v-smd6032; Supplier 1: Digikey; Supplier 1 Part Number: 493-2105-1-ND; Supplier 1 Link: https://www.digikey.com/product-detail/en/nichicon/UWX1C101MCL1GB/493-2105-1-ND/590080
C27-C31 = Cap-10uF-50V-0805: as c12 on sheet POWER_SUPPLY; Local Supplier: thegioiic; Local Supplier Link: https://thegioiic.com/products/tu-10uf-50v-0805; Supplier 1: Digikey; Supplier 1 Link: https://www.digikey.com/product-detail/en/yageo/CC0805KKX5R9BB106/311-3499-2-ND/7164383; Supplier 1 Part Number: 311-3499-2-ND
D5 = LED
D6 = Diode-SS14: DIODE SCHOTTKY 40V 1A SMA; Manufacturer: ON Semiconductor; Local Supplier: thegioiic; Local Supplier Link: https://thegioiic.com/products/ss14-sma; Supplier 1: Digikey; Supplier 1 Link: https://www.digikey.com/product-detail/en/on-semiconductor/SS14/SS14CT-ND/965729; Manufacturer Part Number: SS14; Supplier 1 Part Number: SS14CT-ND
J2 = 105017-0001: No Description Available; Vendor: Molex Connector Corporation; Built_By: EMA_Cory; SourceLibrary: Molex_2020-05-26; Datasheet: https://www.molex.com/pdm_docs/sd/1050170001_sd.pdf; Manufacturer_Part_Number: 105017-0001; Copyright: Copyright (C) 2018 Accelerated Designs. All rights reserved; RefDes: RefDes; Type: DEV
Q3 Q4 = IRLML6402TRPBF: P-Channel 20V 3.7A (Ta) 1.3W (Ta) Surface Mount Micro3™/SOT-23
R20-R30 = Res-0-0805: as R13 on sheet POWER_SUPPLY; Local Supplier: thegioiic; Local Supplier Link: https://thegioiic.com/products/dien-tro-0-ohm-0805-5; Supplier 1: Digikey; Supplier 1 Link: https://www.digikey.com/product-detail/en/vishay-dale/WSL080500000ZEA9/541-3928-1-ND/7423223; Supplier 1 Part Number: 541-3928-1-ND
U5 = CP2102-GM: No Description Available; Vendor: Silicon Labs; Built_By: EMA_UL_Team; SourceLibrary: Silicon_Labs_2015-03-23; Manufacturer_Part_Number: CP2102-GM; Copyright: Copyright (C) 2018 Accelerated Designs. All rights reserved; RefDes: RefDes; Type: DEV
M10 = ESP8266: Local supplier: Hshop; Local supplier link: https://hshop.vn/products/kit-rf-thu-phat-wifi-esp8266-nodemcu; Local supplier number: HS000592; manufacturer: *; Manufacturer Part Number: *

## Sheet RF.SchDoc: RF
size A4
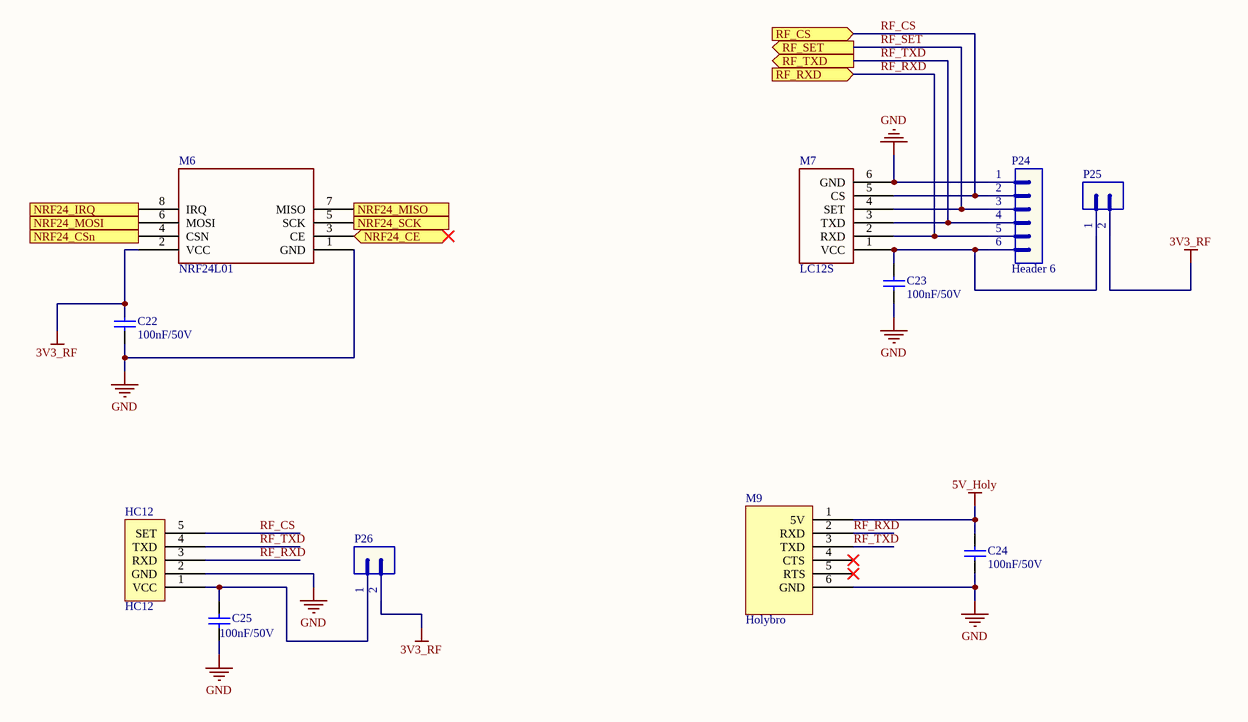
[diagram p6: RF.SchDoc]

### Parts
C22  value 100nF/50V  [CAP-SM-0805]  (hidden comment: Cap-100nF-50V-0805)
C23  value 100nF/50V  [CAP-SM-0805]  (hidden comment: Cap-100nF-50V-0805)
C24  value 100nF/50V  [CAP-SM-0805]  (hidden comment: Cap-100nF-50V-0805)
C25  value 100nF/50V  [CAP-SM-0805]  (hidden comment: Cap-100nF-50V-0805)
HC12  HC12  [HC12]
M6  NRF24L01  [NRF24L01]
M7  LC12S  [LC12S]
M9  Holybro  [Holybro]
P24  Header 6  [JP6]
P25  Header 2  [JP2]  (value not drawn)
P26  Header 2  [JP2]  (value not drawn)

### Ports
NRF24_CE (bidir), NRF24_CSn (in), NRF24_IRQ (out), NRF24_MISO (out), NRF24_MOSI (in), NRF24_SCK (in), RF_CS (in), RF_RXD (in), RF_SET (out), RF_TXD (out)

### Nets
3V3_RF: C22.2 M6.2(VCC) P25.2 P26.2
5V_Holy: C24.2 M9.1(5V)  [project net 5V]
GND: C22.1 C23.1 C24.1 C25.1 HC12.2(GND) M6.1(GND) M7.6(GND) M9.6(GND) P24.1
RF_CS: HC12.5(SET) M7.5(CS) P24.2 ; port RF_CS
RF_RXD: HC12.3(RXD) M7.2(RXD) M9.2(RXD) P24.5 ; port RF_RXD
RF_SET: M7.4(SET) P24.3 ; port RF_SET  [project net BOOT1]
RF_TXD: HC12.4(TXD) M7.3(TXD) M9.3(TXD) P24.4 ; port RF_TXD
Net?_33: M6.8(IRQ) ; port NRF24_IRQ
Net?_38: M6.4(CSN) ; port NRF24_CSn
Net?_39: M6.5(SCK) ; port NRF24_SCK
Net?_40: M6.7(MISO) ; port NRF24_MISO
Net?_41: M6.6(MOSI) ; port NRF24_MOSI
NetC23_2: C23.2 M7.1(VCC) P24.6 P25.1
NetC25_2: C25.2 HC12.1(VCC) P26.1
NetM6_3: M6.3(CE) ; port NRF24_CE

Not connected (* = marked no-connect by the designer): M9 4(CTS)* 5(RTS)*

### Notes on the sheet
- Title
- Size:
- Date:
- A4
- Number:
- Time:
- Revision:
- Sheet
- of
- File:

### Library data of the parts
C22-C25 = Cap-100nF-50V-0805: as C10 on sheet POWER_SUPPLY; Local Supplier: thegioiic; Local Supplier Link: https://thegioiic.com/products/tu-100nf-0-1uf-50v-0805; Supplier 1: Digikey; Supplier 1 Part Number: 1276-1007-1-ND; Supplier 1 Link: https://www.digikey.com/product-detail/en/samsung-electro-mechanics/CL21F104ZBCNNNC/1276-1007-1-ND/3889093
P24 = Header 6: Header, 6-Pin; LatestRevisionDate: 17-Jul-2002; LatestRevisionNote: Re-released for DXP Platform.; Publisher: Altium Limited
P25 P26 = Header 2: Header, 2-Pin; LatestRevisionDate: 17-Jul-2002; LatestRevisionNote: Re-released for DXP Platform.; Publisher: Altium Limited
HC12 = HC12: Local Supplier: Hshop; Local Supplier Link: https://hshop.vn/products/mach-thu-phat-rf-uart-si4463-433mhzkhoang-coch-1km; Local Supplier number Part: HS000897; Manufacturer: *; Manufacturer Part Number: *

## Sheet DACEWAVE.SchDoc: DACEWAVE
size A4
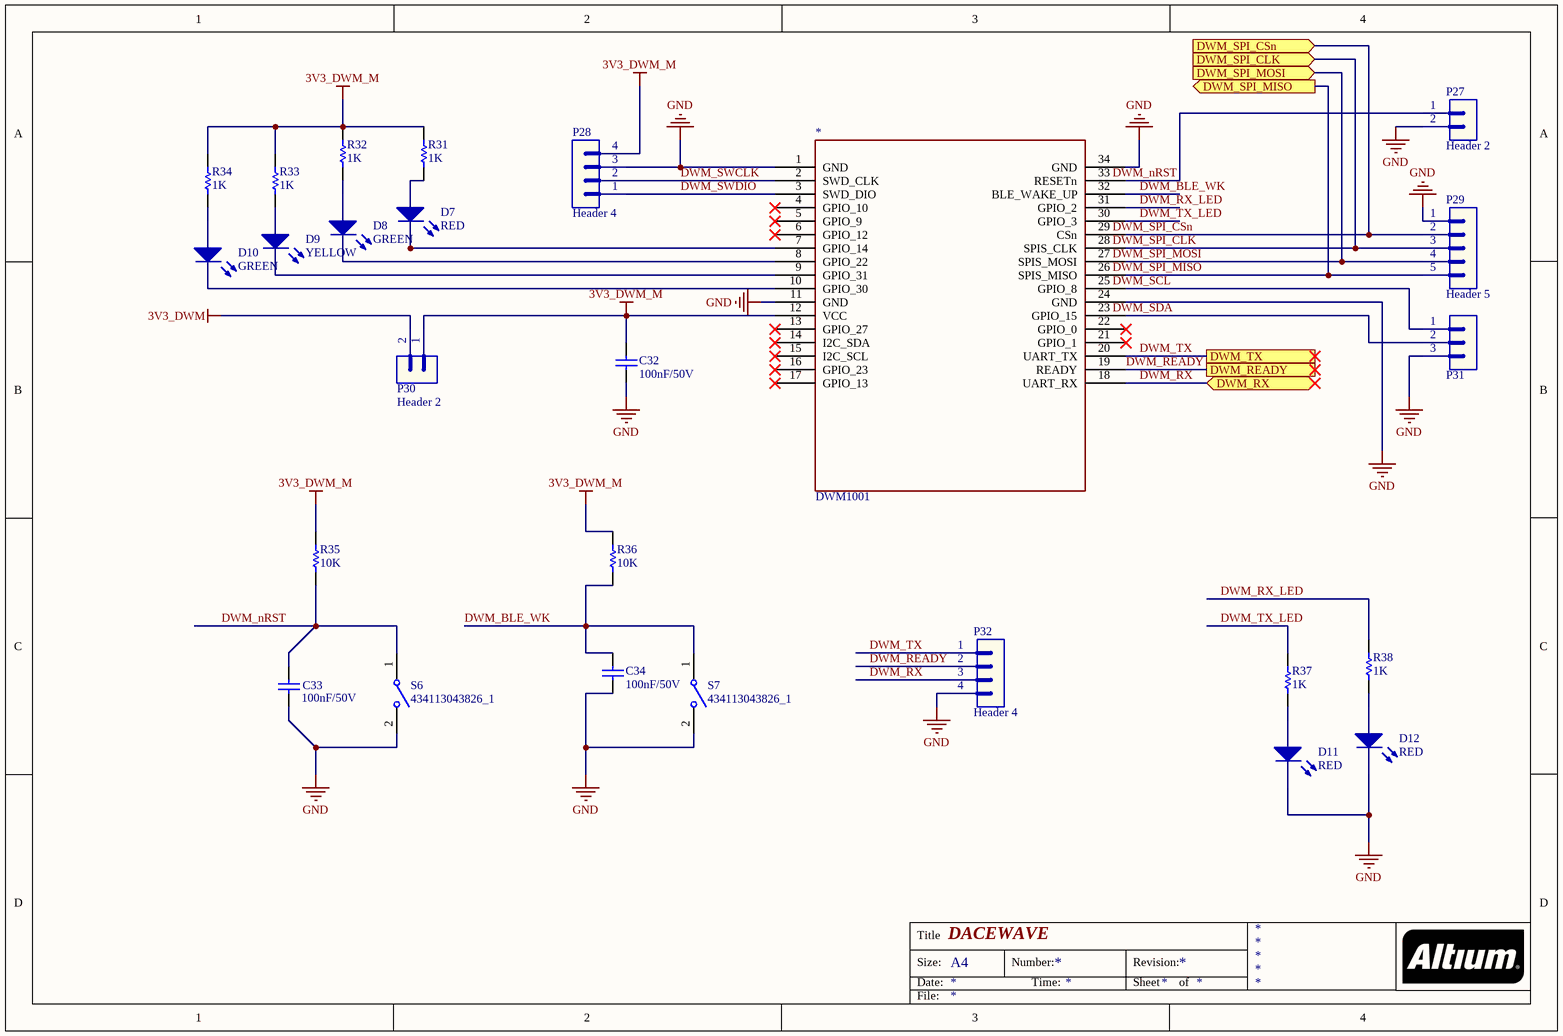
[diagram p7: DACEWAVE.SchDoc]

### Parts
*  DWM1001  [DWM1001]
C32  value 100nF/50V  [CAP-SM-0805]  (hidden comment: Cap-100nF-50V-0805)
C33  value 100nF/50V  [CAP-SM-0805]  (hidden comment: Cap-100nF-50V-0805)
C34  value 100nF/50V  [CAP-SM-0805]  (hidden comment: Cap-100nF-50V-0805)
D7  RED  [LED_0805_Blue]
D8  GREEN  [LED_0805_Blue]
D9  YELLOW  [LED_0805_Blue]
D10  GREEN  [LED_0805_Blue]
D11  RED  [LED_0805_Blue]
D12  RED  [LED_0805_Blue]
P27  Header 2  [JP2]
P28  Header 4  [JP4]
P29  Header 5  [JP5]
P30  Header 2  [JP2]
P31  Header 3  [JP3]  (value not drawn)
P32  Header 4  [JP4]
R31  value 1K  [RES-SM-0805]  (hidden comment: Res-0-0805)
R32  value 1K  [RES-SM-0805]  (hidden comment: Res-0-0805)
R33  value 1K  [RES-SM-0805]  (hidden comment: Res-0-0805)
R34  value 1K  [RES-SM-0805]  (hidden comment: Res-0-0805)
R35  value 10K  [RES-SM-0805]  (hidden comment: Res-0-0805)
R36  value 10K  [RES-SM-0805]  (hidden comment: Res-0-0805)
R37  value 1K  [RES-SM-0805]  (hidden comment: Res-0-0805)
R38  value 1K  [RES-SM-0805]  (hidden comment: Res-0-0805)
S6  434113043826_1  [434113043826]
S7  434113043826_1  [434113043826]

### Ports
DWM_READY, DWM_RX (bidir), DWM_SPI_CLK (in), DWM_SPI_CSn (in), DWM_SPI_MISO (out), DWM_SPI_MOSI (in), DWM_TX

### Nets
3V3_DWM: P30.2
3V3_DWM_M: *.12(VCC) C32.1 P28.4 P30.1 R31.2 R32.2 R33.2 R34.2 R35.2 R36.2
GND: *.1(GND) *.11(GND) *.24(GND) *.34(GND) C32.2 C33.2 C34.2 D11.2(K) D12.2(K) P27.2 P28.3 P29.1 P31.3 P32.4 S6.2 S7.2
DWM_BLE_WK: *.32(BLE_WAKE_UP) C34.1 R36.1 S7.1
DWM_nRST: C33.1 R35.1 S6.1
DWM_READY: *.19(READY) P32.2 ; port DWM_READY
DWM_RX: *.18(UART_RX) P32.3 ; port DWM_RX
DWM_RX_LED: *.31(GPIO_2) R38.2
DWM_SWCLK: *.2(SWD_CLK) P28.2
DWM_SWDIO: *.3(SWD_DIO) P28.1
DWM_TX: *.20(UART_TX) P32.1 ; port DWM_TX
DWM_TX_LED: *.30(GPIO_3) R37.2
Net*_7: *.7(GPIO_14) D7.2(K)
Net*_8: *.8(GPIO_22) D8.2(K)
Net*_9: *.9(GPIO_31) D9.2(K)
Net*_10: *.10(GPIO_30) D10.2(K)
Net*_23: *.23(GPIO_15) P31.2
Net*_25: *.25(GPIO_8) P31.1
Net*_26: *.26(SPIS_MISO) P29.5 ; port DWM_SPI_MISO
Net*_27: *.27(SPIS_MOSI) P29.4 ; port DWM_SPI_MOSI
Net*_28: *.28(SPIS_CLK) P29.3 ; port DWM_SPI_CLK
Net*_29: *.29(CSn) P29.2 ; port DWM_SPI_CSn
Net*_33: *.33(RESETn) P27.1
NetD7_1: D7.1(A) R31.1
NetD8_1: D8.1(A) R32.1
NetD9_1: D9.1(A) R33.1
NetD10_1: D10.1(A) R34.1
NetD11_1: D11.1(A) R37.1
NetD12_1: D12.1(A) R38.1

Not connected (* = marked no-connect by the designer): * 4(GPIO_10)* 5(GPIO_9)* 6(GPIO_12)* 13(GPIO_27)* 14(I2C_SDA)* 15(I2C_SCL)* 16(GPIO_23)* 17(GPIO_13)* 21(GPIO_1)* 22(GPIO_0)*

### Notes on the sheet
- Labels drawn without touching a wire or pin: DWM_nRST, DWM_SCL, DWM_SDA, DWM_SPI_CLK, DWM_SPI_CSn, DWM_SPI_MISO, DWM_SPI_MOSI
- Title
- Size:
- Date:
- A4
- Number:
- Time:
- Revision:
- Sheet
- of
- File:

### Library data of the parts
C32-C34 = Cap-100nF-50V-0805: as C10 on sheet POWER_SUPPLY; Local Supplier: thegioiic; Local Supplier Link: https://thegioiic.com/products/tu-100nf-0-1uf-50v-0805; Supplier 1: Digikey; Supplier 1 Part Number: 1276-1007-1-ND; Supplier 1 Link: https://www.digikey.com/product-detail/en/samsung-electro-mechanics/CL21F104ZBCNNNC/1276-1007-1-ND/3889093
D7-D12 = LED
P27 P30 = Header 2: Header, 2-Pin; LatestRevisionDate: 17-Jul-2002; LatestRevisionNote: Re-released for DXP Platform.; Publisher: Altium Limited
P28 P32 = Header 4: Header, 4-Pin; LatestRevisionDate: 17-Jul-2002; LatestRevisionNote: Re-released for DXP Platform.; Publisher: Altium Limited
P29 = Header 5: Header, 5-Pin; LatestRevisionDate: 17-Jul-2002; LatestRevisionNote: Re-released for DXP Platform.; Publisher: Altium Limited
P31 = Header 3: Header, 3-Pin; LatestRevisionDate: 17-Jul-2002; LatestRevisionNote: Re-released for DXP Platform.; Publisher: Altium Limited
R31-R38 = Res-0-0805: as R13 on sheet POWER_SUPPLY; Local Supplier: thegioiic; Local Supplier Link: https://thegioiic.com/products/dien-tro-0-ohm-0805-5; Supplier 1: Digikey; Supplier 1 Link: https://www.digikey.com/product-detail/en/vishay-dale/WSL080500000ZEA9/541-3928-1-ND/7423223; Supplier 1 Part Number: 541-3928-1-ND
S6 S7 = 434113043826_1: as S5 on sheet BLUETOOTH; ComponentLink1Description: Manufacturer; ComponentLink1URL: http://www.we-online.de; ComponentLink2Description: Datasheet; ComponentLink2URL: https://katalog.we-online.com/em/datasheet/434113043826.pdf; Operating Temperature: -40 to +85degC; Part Number: 434113043826; Published Date: September 2019; Contact Material: Stainless Steel; Height: 4.3mm; Mounting Technology: SMT; Contact Plating: Silver; Operation Force: 260gf; Packaging: Tape and Reel; Terminal Material: Copper Alloy; Publisher: Wurth Elektronik; Terminal Plating: Silver

## Nets that join several sheets
3V3_BLU: POWER_SUPPLY (C18.2 IC4.2 IC4.4), BLUETOOTH (M5.12 S5.1)
3V3_DWM: POWER_SUPPLY (C15.2 IC3.2 IC3.4), DACEWAVE (P30.2)
3V3_MCU: POWER_SUPPLY (C13.2 C14.2 IC2.2 IC2.4), MCU (12 pins), SENSOR (6 pins), MOTOR_CONTROL (11 pins)
3V3_RF: POWER_SUPPLY (C17.2 U3.5), RF (C22.2 M6.2 P25.2 P26.2)
3V3_WIFI: POWER_SUPPLY (c12.2 IC1.2 IC1.4), WIFI (12 pins)
5V: POWER_SUPPLY (10 pins), MCU (B1.1 J1.1), MOTOR_CONTROL (P6.3), BLUETOOTH (C21.2 M4.5), RF (C24.2 M9.1)
5V_WIFI: POWER_SUPPLY (IC1.3 P19.2), WIFI (C30.1 C31.1 D6.1 U5.8)
12V: POWER_SUPPLY (C9.1 C10.2 P18.1 PI1.1), MOTOR_CONTROL (P4.1 P5.1)
GND: POWER_SUPPLY (19 pins), MCU (17 pins), SENSOR (6 pins), MOTOR_CONTROL (19 pins), BLUETOOTH (10 pins), WIFI (14 pins), RF (9 pins), DACEWAVE (16 pins)
BLUE_ENB: MCU (?.32), BLUETOOTH (M4.6 R18.1 S5.2)
BLUE_RX: MCU (?.30), BLUETOOTH (M4.2 M5.2 P23.2)
BLUE_TX: MCU (?.31), BLUETOOTH (M4.3 M5.1 P23.1)
BOOT1: MCU (?.19 P2.2 R5.2), RF (M7.4 P24.3)
ESP_TX: MCU (?.13), WIFI (M10.22 U5.25)
Net*_26: MCU (?.27), DACEWAVE (*.26 P29.5)
Net*_27: MCU (?.28), DACEWAVE (*.27 P29.4)
Net*_28: MCU (?.26), DACEWAVE (*.28 P29.3)
Net*_29: MCU (?.25), DACEWAVE (*.29 P29.2)
Net?_3: MCU (?.3), MOTOR_CONTROL (U2.3)
Net?_4: MCU (?.4), MOTOR_CONTROL (U2.6)
Net?_5: MCU (?.5), MOTOR_CONTROL (U2.5)
Net?_6: MCU (?.6), MOTOR_CONTROL (U2.7)
Net?_10: MCU (?.10), MOTOR_CONTROL (U2.2)
Net?_11: MCU (?.11), MOTOR_CONTROL (U2.4)
Net?_12: MCU (?.12), WIFI (R21.1)
Net?_14: MCU (?.14), BLUETOOTH (M5.11)
Net?_15: POWER_SUPPLY (R14.1), MCU (?.15)
Net?_16: MCU (?.16), SENSOR (U4.2)
Net?_17: MCU (?.17), SENSOR (U4.4)
Net?_33: MCU (?.33), RF (M6.8)
Net?_38: MCU (?.38), RF (M6.4)
Net?_39: MCU (?.39), RF (M6.5)
Net?_40: MCU (?.40), RF (M6.7)
Net?_41: MCU (?.41), RF (M6.6)
Net?_42: MCU (?.42), SENSOR (U4.8)
Net?_43: MCU (?.43), SENSOR (U4.6)
Net?_45: MCU (?.45), SENSOR (M3.3)
Net?_46: MCU (?.46), SENSOR (M3.4)
RF_RXD: MCU (?.21), RF (HC12.3 M7.2 M9.2 P24.5)
RF_TXD: MCU (?.22), RF (HC12.4 M7.3 M9.3 P24.4)